# Altium schematic sheet parent.SchDoc
size B
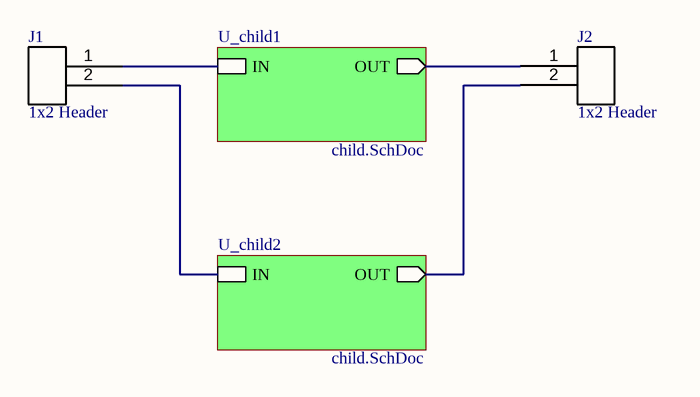
[diagram p0: parent.SchDoc]

## Parts
J1  1x2 Header  [100_1_2]
J2  1x2 Header  [100_1_2]

## Sub-sheets
U_child1 = child.SchDoc: IN, OUT (out)
U_child2 = child.SchDoc: IN, OUT (out)

## Nets
NetJ1_1: J1.1 ; sheet U_child1/IN
NetJ1_2: J1.2 ; sheet U_child2/IN
NetJ2_1: J2.1 ; sheet U_child1/OUT
NetJ2_2: J2.2 ; sheet U_child2/OUT

## Library data of the parts
J1 J2 = 100_1_2: Generic 1x2 2.54mm pitch header; Manufacturer 1: HCTL; Manufacturer Part Number 1: PZ254-1-02-Z-8.5; manufacturer: Wavenumber; classification: connector/generic_2_54mm_header; id: 019a404e-43ec-7727-8aa5-54ca39edb9e9; kicad-footprint-path: footprints\100_1_2.kicad_mod; kicad-symbol-path: symbols\CON-1-2.kicad_sym; cad-reference: 100_1_2; kicad-footprint: 100_1_2; kicad-symbol: CON-1-2; mpn: 100_1_2; Value: 1x2 Header